# EAGLE design Arduino-Shield (EAGLE 9.6.2)
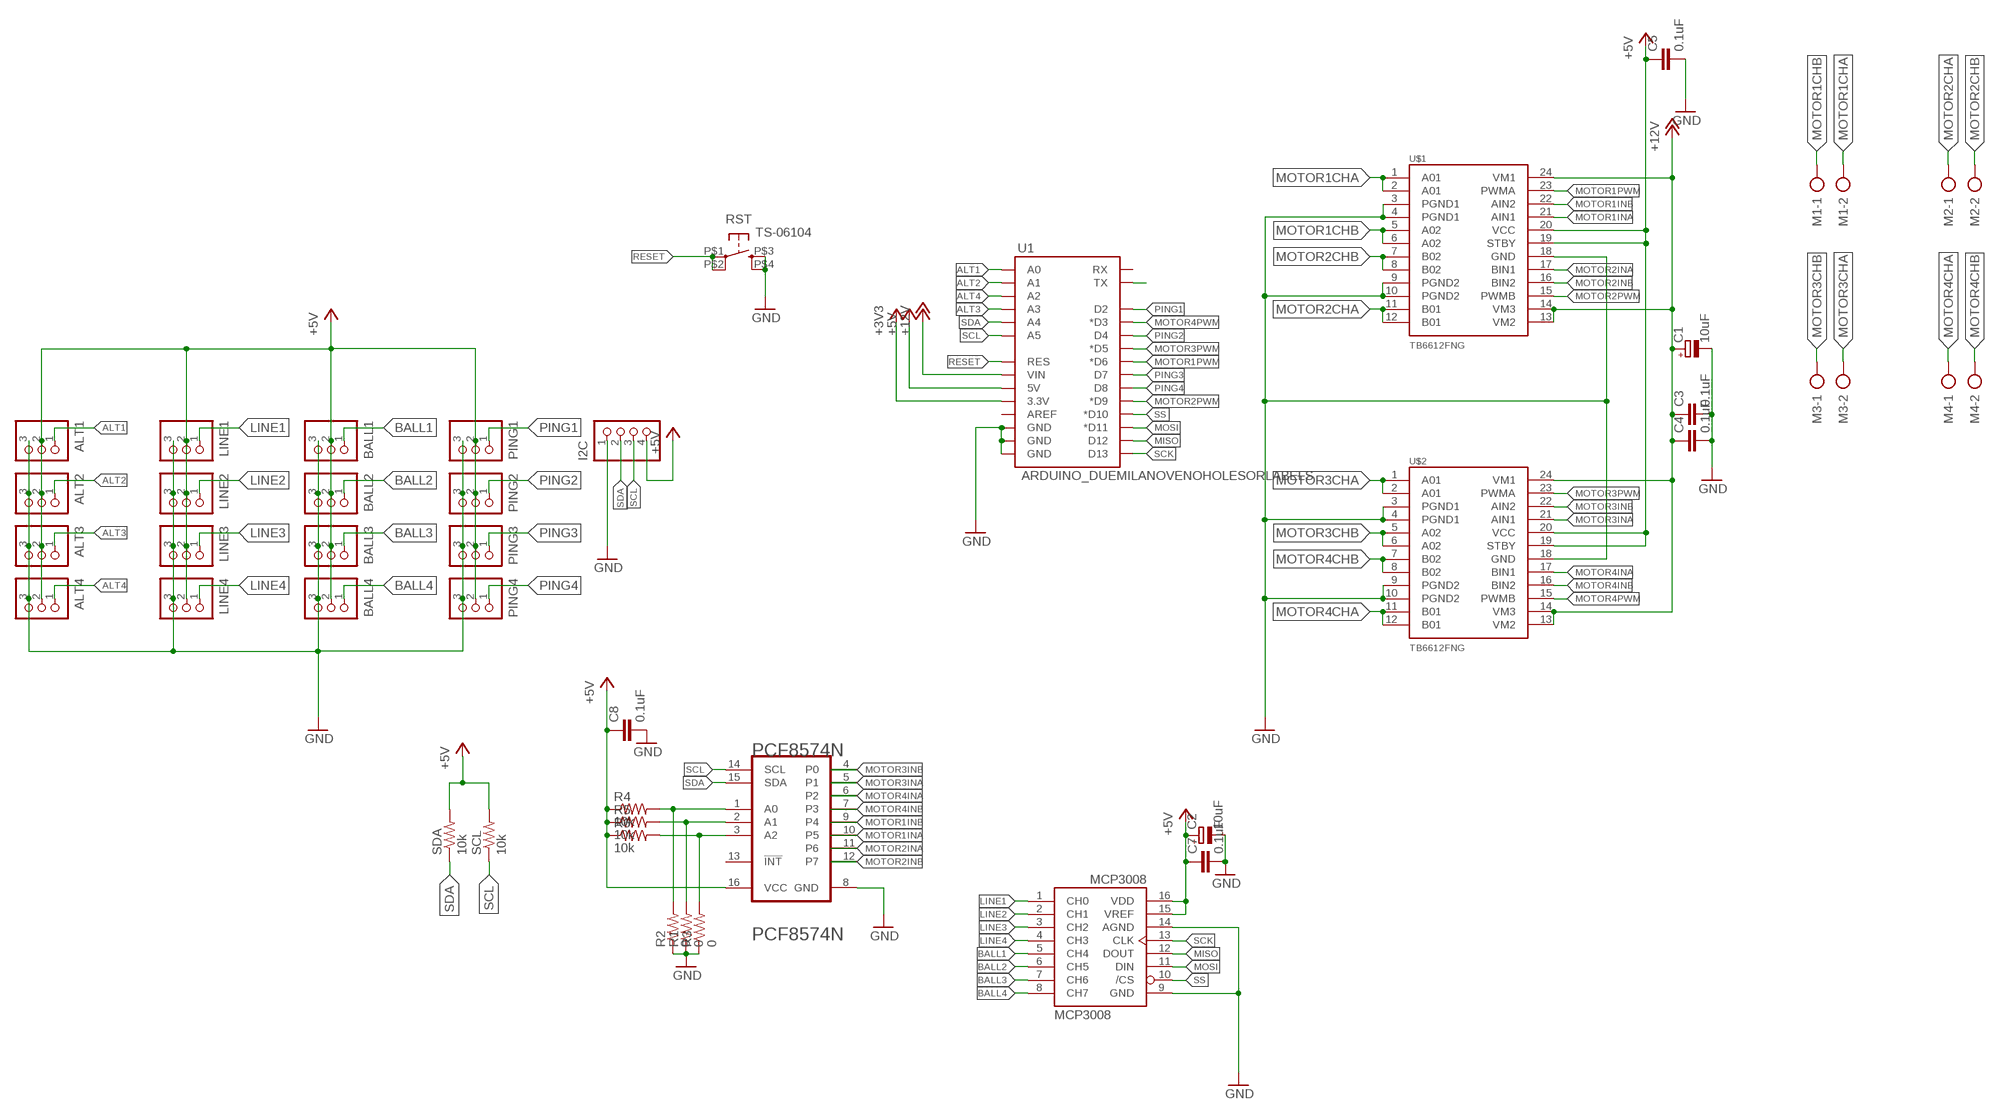
[diagram p0: schematic, sheet 1]

## Parts
ALT1  B3B-XH-A  [B3B-XH-A]
ALT2  B3B-XH-A  [B3B-XH-A]
ALT3  B3B-XH-A  [B3B-XH-A]
ALT4  B3B-XH-A  [B3B-XH-A]
BALL1  B3B-XH-A  [B3B-XH-A]
BALL2  B3B-XH-A  [B3B-XH-A]
BALL3  B3B-XH-A  [B3B-XH-A]
BALL4  B3B-XH-A  [B3B-XH-A]
C1  10uF  CPOL-EUE2-5  [E2-5]
C2  10uF  CPOL-EUE2-5  [E2-5]
C3  0.1uF  C-EUC1608  [C1608]
C4  0.1uF  C-EUC1608  [C1608]
C5  0.1uF  C-EUC1608  [C1608]
C7  0.1uF  C-EUC1608  [C1608]
C8  0.1uF  C-EUC1608  [C1608]
I2C  B4B-XH-A  [B4B-XH-A]
LINE1  B3B-XH-A  [B3B-XH-A]
LINE2  B3B-XH-A  [B3B-XH-A]
LINE3  B3B-XH-A  [B3B-XH-A]
LINE4  B3B-XH-A  [B3B-XH-A]
M1  AK500/2-H  [AK500/2-H]
M2  AK500/2-H  [AK500/2-H]
M3  AK500/2-H  [AK500/2-H]
M4  AK500/2-H  [AK500/2-H]
MCP3008  MCP3008  [DIL16]
PCF8574N  TEXAS_INSTRUMENTS_PCF8574NTEXAS_INSTRUMENTS_PCF8574N_0_0  [TEXAS_INSTRUMENTS_PCF8574N_0]
PING1  B3B-XH-A  [B3B-XH-A]
PING2  B3B-XH-A  [B3B-XH-A]
PING3  B3B-XH-A  [B3B-XH-A]
PING4  B3B-XH-A  [B3B-XH-A]
R1  0  R-US_M2012  [M2012]
R2  0  R-US_M2012  [M2012]
R3  0  R-US_M2012  [M2012]
R4  10k  R-US_R0603  [R0603]
R5  10k  R-US_R0603  [R0603]
R6  10k  R-US_R0603  [R0603]
RST  TS-06104  [TS-06104]
SCL  10k  R-US_R0603  [R0603]
SDA  10k  R-US_R0603  [R0603]
U1  ARDUINO_DUEMILANOVENOHOLESORLABELS  [DUEMILANOVE_SHIELD_NOHOLES_NOLABELS]
U$1  TB6612FNG  [SSOP24]
U$2  TB6612FNG  [SSOP24]

## Nets
+3V3: U1.3.3V
+5V: ALT1.2 ALT2.2 ALT3.2 ALT4.2 BALL1.2 BALL2.2 BALL3.2 BALL4.2 C2.+ C5.1 C7.1 C8.1 I2C.4 LINE1.2 LINE2.2 LINE3.2 LINE4.2 MCP3008.15(VREF) MCP3008.16(VDD) PCF8574N.16(VCC) PING1.2 PING2.2 PING3.2 PING4.2 R4.1 R5.1 R6.1 SCL.2 SDA.2 U1.5V U$1.19(STBY) U$1.20(VCC) U$2.19(STBY) U$2.20(VCC)
+12V: C1.+ C3.1 C4.1 U1.VIN U$1.13(VM2) U$1.14(VM3) U$1.24(VM1) U$2.13(VM2) U$2.14(VM3) U$2.24(VM1)
ALT1: ALT1.1 U1.A0
ALT2: ALT2.1 U1.A1
ALT3: ALT3.1 U1.A3
ALT4: ALT4.1 U1.A2
BALL1: BALL1.1 MCP3008.5(CH4)
BALL2: BALL2.1 MCP3008.6(CH5)
BALL3: BALL3.1 MCP3008.7(CH6)
BALL4: BALL4.1 MCP3008.8(CH7)
GND: ALT1.3 ALT2.3 ALT3.3 ALT4.3 BALL1.3 BALL2.3 BALL3.3 BALL4.3 C1.- C2.- C3.2 C4.2 C5.2 C7.2 C8.2 I2C.1 LINE1.3 LINE2.3 LINE3.3 LINE4.3 MCP3008.9(GND) MCP3008.14(AGND) PCF8574N.8(GND) PING1.3 PING2.3 PING3.3 PING4.3 R1.1 R2.1 R3.1 RST.P$3 RST.P$4 U1.GND@0(GND) U1.GND@1(GND) U1.GND@2(GND) U$1.3(PGND1) U$1.4(PGND1) U$1.9(PGND2) U$1.10(PGND2) U$1.18(GND) U$2.3(PGND1) U$2.4(PGND1) U$2.9(PGND2) U$2.10(PGND2) U$2.18(GND)
LINE1: LINE1.1 MCP3008.1(CH0)
LINE2: LINE2.1 MCP3008.2(CH1)
LINE3: LINE3.1 MCP3008.3(CH2)
LINE4: LINE4.1 MCP3008.4(CH3)
MISO: MCP3008.12(DOUT) U1.D12
MOSI: MCP3008.11(DIN) U1.D11(*D11)
MOTOR1CHA: M1.2 U$1.1(A01) U$1.2(A01)
MOTOR1CHB: M1.1 U$1.5(A02) U$1.6(A02)
MOTOR1INA: PCF8574N.10(P5) U$1.21(AIN1)
MOTOR1INB: PCF8574N.9(P4) U$1.22(AIN2)
MOTOR1PWM: U1.D6(*D6) U$1.23(PWMA)
MOTOR2CHA: M2.1 U$1.11(B01) U$1.12(B01)
MOTOR2CHB: M2.2 U$1.7(B02) U$1.8(B02)
MOTOR2INA: PCF8574N.11(P6) U$1.17(BIN1)
MOTOR2INB: PCF8574N.12(P7) U$1.16(BIN2)
MOTOR2PWM: U1.D9(*D9) U$1.15(PWMB)
MOTOR3CHA: M3.2 U$2.1(A01) U$2.2(A01)
MOTOR3CHB: M3.1 U$2.5(A02) U$2.6(A02)
MOTOR3INA: PCF8574N.5(P1) U$2.21(AIN1)
MOTOR3INB: PCF8574N.4(P0) U$2.22(AIN2)
MOTOR3PWM: U1.D5(*D5) U$2.23(PWMA)
MOTOR4CHA: M4.1 U$2.11(B01) U$2.12(B01)
MOTOR4CHB: M4.2 U$2.7(B02) U$2.8(B02)
MOTOR4INA: PCF8574N.6(P2) U$2.17(BIN1)
MOTOR4INB: PCF8574N.7(P3) U$2.16(BIN2)
MOTOR4PWM: U1.D3(*D3) U$2.15(PWMB)
N$1: PCF8574N.1(A0) R2.2 R4.2
N$2: PCF8574N.2(A1) R1.2 R5.2
N$3: PCF8574N.3(A2) R3.2 R6.2
PING1: PING1.1 U1.D2
PING2: PING2.1 U1.D4
PING3: PING3.1 U1.D7
PING4: PING4.1 U1.D8
RES2: U1.TX
RESET: RST.P$1 RST.P$2 U1.RES
SCK: MCP3008.13(CLK) U1.D13
SCL: I2C.3 PCF8574N.14(SCL) SCL.1 U1.A5
SDA: I2C.2 PCF8574N.15(SDA) SDA.1 U1.A4
SS: MCP3008.10(/CS) U1.D10(*D10)
Unconnected: PCF8574N.13(!INT!) U1.AREF U1.RX

## Library data of the parts
ALT1-ALT4 BALL1-BALL4 LINE1-LINE4 PING1-PING4 = jst-xh:B3B-XH-A: Wire-to-Board 2.5mm pitch top mount connector Source: http://www.jst-mfg.com/product/pdf/jpn/XH.pdf http://www.jst-mfg.com/product/detail.php?series=277
C1 C2 = rcl:CPOL-EU: POLARIZED CAPACITOR, European symbol; SPICEPREFIX: C
C3-C5 C7 C8 = rcl:C-EU: CAPACITOR, European symbol; SPICEPREFIX: C
I2C = jst-xh:B4B-XH-A: Wire-to-Board 2.5mm pitch top mount connector Source: http://www.jst-mfg.com/product/pdf/jpn/XH.pdf http://www.jst-mfg.com/product/detail.php?series=277
M1-M4 = con-ptr500:AK500/2-H: CONNECTOR Aug. 2004 / PTR Meßtechnik: Die Bezeichnung der Serie AK505 wurde geändert. Es handelt sich hierbei um AK500 in horizontaler Ausführung.; OC_FARNELL: unknown; OC_NEWARK: unknown
MCP3008 = adafruit:MCP3008
PCF8574N = Texas Instruments - PCF8574N:TEXAS_INSTRUMENTS_PCF8574N: TI-PCF8574-PDIP_N-16; CIIVA_IDS: 13592404; CODE__JEDEC: MS-001*; COMPONENT_LINK_2_DESCRIPTION: Package Specification; COMPONENT_LINK_2_URL: http://www.ti.com/litv/pdf/mpdi002c; DATASHEET: http://www.ti.com/general/docs/lit/getliterature.tsp?genericPartNumber=PCF8574&fileType=pdf; DATASHEET_VERSION: SCPS068G; FOOTPRINT_VARIANT_NAME_0: Manufacturer Recommended; F_SCLK_MAX_MHZ: 0.1; I2C_ADDRESS: 0100 xxx; IMPORTED: yes; IMPORTED_FROM: vault; IMPORT_TS: 1521849915; INTERRUPT_OUTPUT: Yes; MAX_FREQUENCYKHZ: 100; MF: Texas Instruments; MOUNTING_TECHNOLOGY: Through-hole; MPN: PCF8574N; OF_IOS: 8; PACKAGE: N0016A; PACKAGE_DESCRIPTION: 16-Pin Plastic Dual-In-Line Package, Row Spacing 7.62 mm, Pitch 2.54 mm; PACKAGE_VERSION: revE, Dec-2002; PIN_0_0_13_INSIDE_EDGE: clock; PREFIX: U; PUSH_PULL_IO_TYPE: Yes; RELEASE_DATE: 1464327319; RESET_INPUT: No; ROHS: Yes; SUB_FAMILY: I2C IO Expander; VAULT_GUID: 6B0A092C-00FE-4CEB-88E1-FCBDED8643F9; VAULT_REVISION: 6B172042-FB17-4171-84B5-EE9A058F64BE; VCC_MAX_V: 6; VCC_MIN_V: 2.5; VCC_RANGEV: 2.5 to 6.0; VOLTAGE_NODESV: 5, 3.3
R1-R6 SCL SDA = rcl:R-US_: RESISTOR, American symbol; SPICEPREFIX: R
RST = 0@Mylibrary-main1:TS-06104
U1 = SparkFun-Retired:ARDUINO_DUEMILANOVE: Arduino Duemilanove Shield Footprint Shield form compatible with the Arduino Duemilanove.
U$1 U$2 = SparkFun-IC-Special-Function:TB6612FNG: Toshiba 1A dual motor driver IC-09363; PROD_ID: IC-09363

## Board
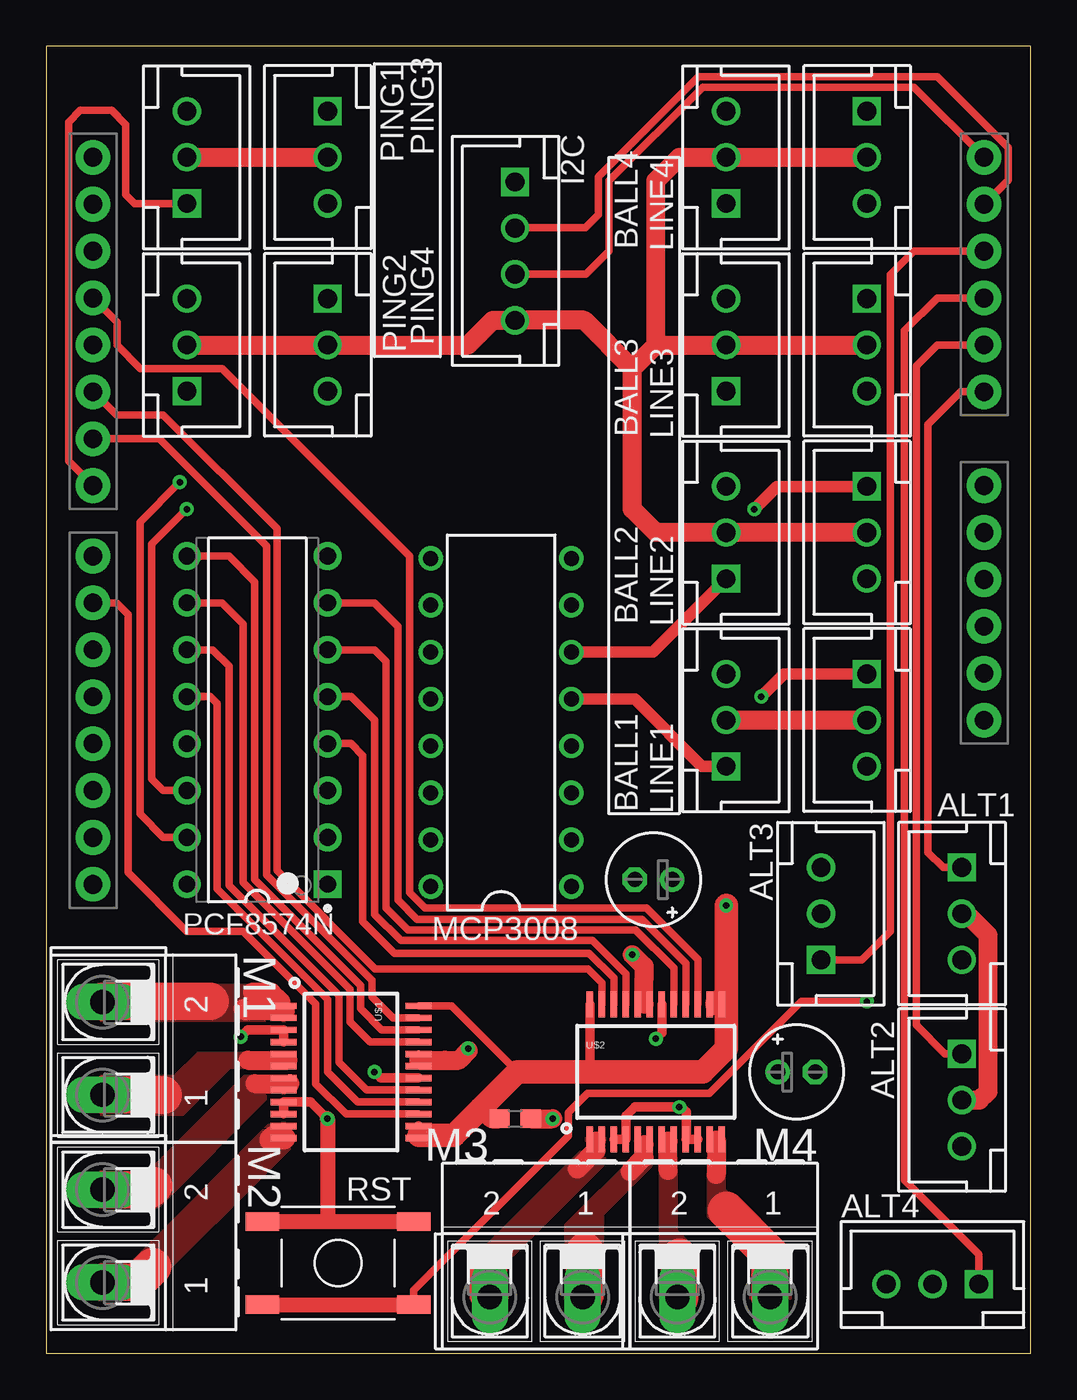
[diagram p1: board, top side]
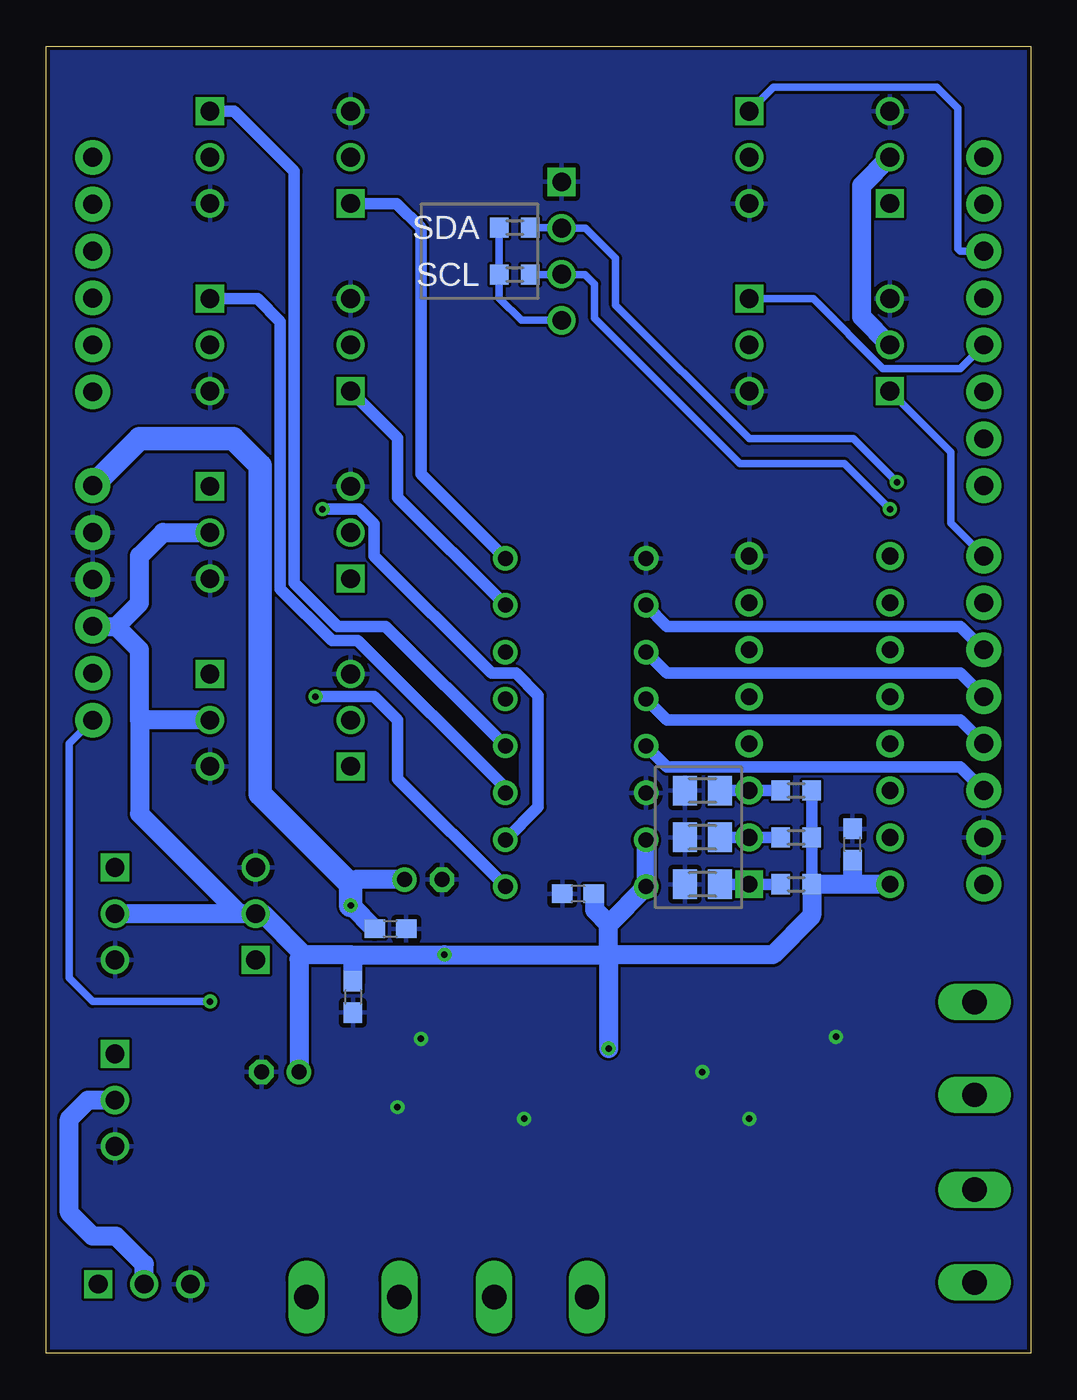
[diagram p2: board, bottom side, seen from below]

Size 53.32 x 70.79 mm. Coordinates in mm from the lower left corner, seen from the top.
Outline: 0,0 53.32,0 53.32,70.79 0,70.79 0,0
Copper layers (1*16): Top 0.035mm / dielectric 1.5mm / Bottom 0.035mm
Design rules "PCBGoGo": minimum track width 6mil, minimum drill 0.2mm, track to track 6mil, track to pad 6mil, pad to pad 6mil, via to via 6mil, smd to smd 6mil, copper to edge 0.2mm, drill to drill 6mil, minimum pad ring 10mil, minimum via ring 8mil, stop-mask expansion 4mil, vias tented up to drill 0mil, thermal gap 10mil
bRestrict: 7 lines

### Footprints (pad centres in the part's own frame; a part is rotated, then mirrored left to right if it is on the bottom)
B3B-XH-A = drill 1.016 square: 1 -2.5,0 | drill 1.016: 2 0,0; 3 2.5,0
E2-5 = drill 0.813 pad 1.27: + -1.016,0 | drill 0.813 pad 1.27 octagon: - 1.016,0
C1608 = smd 1.1 x 1: 1 -0.85,0; 2 0.85,0
B4B-XH-A = drill 1.016 square: 1 -3.75,0 | drill 1.016: 2 -1.25,0; 3 1.25,0; 4 3.75,0
AK500/2-H = drill 1.321 long: 1 -2.515,0; 2 2.515,0
DIL16 = drill 0.813: 1 -8.89,-3.81; 2 -6.35,-3.81; 3 -3.81,-3.81; 4 -1.27,-3.81; 5 1.27,-3.81; 6 3.81,-3.81; 7 6.35,-3.81; 8 8.89,-3.81; 9 8.89,3.81; 10 6.35,3.81; 11 3.81,3.81; 12 1.27,3.81; 13 -1.27,3.81; 14 -3.81,3.81; 15 -6.35,3.81; 16 -8.89,3.81
TEXAS_INSTRUMENTS_PCF8574N_0 = drill 0.9 pad 1.5 square: 1 -3.81,8.89 | drill 0.9 pad 1.5: 2 -3.81,6.35; 3 -3.81,3.81; 4 -3.81,1.27; 5 -3.81,-1.27; 6 -3.81,-3.81; 7 -3.81,-6.35; 8 -3.81,-8.89; 9 3.81,-8.89; 10 3.81,-6.35; 11 3.81,-3.81; 12 3.81,-1.27; 13 3.81,1.27; 14 3.81,3.81; 15 3.81,6.35; 16 3.81,8.89
M2012 = smd 1.3 x 1.6: 1 -0.95,0; 2 0.95,0
R0603 = smd 1 x 1.1: 1 -0.85,0; 2 0.85,0
TS-06104 = smd 1.8 x 1: P$1 4.1,2.25; P$2 -4.1,2.25; P$3 -4.1,-2.25; P$4 4.1,-2.25
DUEMILANOVE_SHIELD_NOHOLES_NOLABELS = drill 1.016 pad 1.88: 3.3V 50.8,26.67; 5V 50.8,29.21; A0 50.8,41.91; A1 50.8,44.45; A2 50.8,46.99; A3 50.8,49.53; A4 50.8,52.07; A5 50.8,54.61; AREF 2.54,15.24; D2 2.54,49.53; D3 2.54,46.99; D4 2.54,44.45; D5 2.54,41.91; D6 2.54,39.37; D7 2.54,36.83; D8 2.54,33.02; D9 2.54,30.48; D10 2.54,27.94; D11 2.54,25.4; D12 2.54,22.86; D13 2.54,20.32; GND@0 50.8,31.75; GND@1 50.8,34.29; GND@2 2.54,17.78; RES 50.8,24.13; RX 2.54,54.61; TX 2.54,52.07; VIN 50.8,36.83
SSOP24 = smd 0.348 x 1.397: 1 -3.575,-3.656; 2 -2.925,-3.656; 3 -2.275,-3.656; 4 -1.625,-3.656; 5 -0.975,-3.656; 6 -0.325,-3.656; 7 0.325,-3.656; 8 0.975,-3.656; 9 1.625,-3.656; 10 2.275,-3.656; 11 2.925,-3.656; 12 3.575,-3.656; 13 3.575,3.656; 14 2.925,3.656; 15 2.275,3.656; 16 1.625,3.656; 17 0.975,3.656; 18 0.325,3.656; 19 -0.325,3.656; 20 -0.975,3.656; 21 -1.625,3.656; 22 -2.275,3.656; 23 -2.925,3.656; 24 -3.575,3.656

### Placement (x,y rotation side)
ALT1  49.59,23.81 270 top
ALT2  49.59,13.72 270 top
ALT3  41.97,23.81 90 top
ALT4  48.01,3.75 180 top
BALL1  36.83,34.29 90 top
BALL2  36.83,44.45 90 top
BALL3  36.83,54.61 90 top
BALL4  36.83,64.77 90 top
C1  32.89,25.65 180 top
C2  40.64,15.24 0 top
C3  25.4,12.7 0 top
C4  34.67,22.99 0 bottom
C5  9.65,27.56 90 bottom
C7  24.51,24.89 180 bottom
C8  36.7,19.3 270 bottom
I2C  25.4,59.69 270 top
LINE1  44.45,34.29 270 top
LINE2  44.45,44.45 270 top
LINE3  44.45,54.61 270 top
LINE4  44.45,64.77 270 top
M1  3.05,16.51 90 top
M2  3.05,6.35 90 top
M3  26.54,3.05 180 top
M4  36.7,3.05 180 top
MCP3008  24.64,34.16 90 top
PCF8574N  11.43,34.29 180 top
PING1  15.24,64.77 270 top
PING2  15.24,54.61 270 top
PING3  7.62,64.77 90 top
PING4  7.62,54.61 90 top
R1  17.78,27.94 0 bottom
R2  17.78,25.4 0 bottom
R3  17.78,30.48 0 bottom
R4  12.7,25.4 180 bottom
R5  12.7,27.94 180 bottom
R6  12.7,30.48 180 bottom
RST  15.81,4.89 180 top
SCL  27.94,58.42 180 bottom
SDA  27.94,60.96 180 bottom
U1  0,10.16 0 top
U$1  16.51,15.24 270 top
U$2  33.02,15.24 0 top
U$3  [RODEP2]  30.48,10.16 0 bottom

### Tracks (layer width: path | path; a pad name or v marks a point on that pad's centre or on a via)
+5V  (via drill 0.35)
  Top 0.406: U$2.20 U$2.19 32.38,19.21 32.38,20.32 | U$1.20 U$1.19 20.48,15.87 21.59,15.87
  Top 0.508: v22.86,16.51 22.86,16.38
  Top 1.016: LINE4.2 BALL4.2 34.29,64.77 33.02,63.5 33.02,54.61 | BALL1.2 LINE1.2 | LINE2.2 BALL2.2 33.02,44.45 31.75,45.72 31.75,53.34 | 33.02,54.61 31.75,53.34 | 33.02,54.61 BALL3.2 LINE3.2 | 31.75,53.34 29.15,55.94 I2C.4 24.19,55.94 22.86,54.61 PING2.2 PING4.2 | PING3.2 PING1.2 | 20.19,15.87 21.59,15.87 22.35,15.87 22.86,16.38 | 32.38,18.92 32.38,20.32 32.38,20.95 v31.75,21.59 | ALT1.2 49.85,23.81 51.02,22.64 51.02,14.19 50.55,13.72 ALT2.2
  Bottom 0.406: SDA.2 SCL.2 28.79,57.15 27.58,55.94 I2C.4
  Bottom 0.61: R6.1 R5.1 R4.1
  Bottom 1.016: PCF8574N.16 9.65,25.4 | 9.65,25.4 R4.1 11.85,23.71 13.97,21.59 22.86,21.59 | 36.83,21.59 39.37,21.59 | 36.83,21.59 v31.75,21.59 22.86,21.59 | 22.86,21.59 v22.86,16.51 | 49.53,39.37 48.26,38.1 48.26,34.29 | U1.5V 49.53,39.37 | 48.26,34.29 48.26,29.21 42.86,23.81 ALT3.2 | 49.53,39.37 48.26,40.64 48.26,43.18 46.99,44.45 LINE2.2 | LINE1.2 48.26,34.29 | MCP3008.15 MCP3008.16 22.86,23.24 | 22.86,21.59 22.86,23.24 | PING4.2 9.14,56.13 9.14,63.25 PING3.2 | C8.1 36.7,21.46 36.83,21.59 | C7.1 23.62,24.85 23.62,24 22.86,23.24 | C5.1 9.65,25.4 | ALT3.2 41.59,23.81 39.37,21.59 | 39.37,21.59 39.62,21.34 C2.+ | ALT4.2 48.01,4.83 49.53,6.35 50.8,6.35 52.07,7.62 52.07,12.7 51.05,13.72 ALT2.2 | ALT1.2 ALT3.2
+12V  (via drill 0.35)
  Top 0.406: 25.53,15.24 21.95,18.81 U$1.24
  Top 0.508: U$2.24 29.45,15.47 29.21,15.24 | U$2.14 36.1,19.05 36.83,19.05 36.68,18.9 U$2.13 | U$1.14 U$1.13 20.17,11.78 20.19,11.81
  Top 1.016: 23.56,13.27 24.13,12.7 C3.1
  Top 1.27: 36.32,18.92 36.83,19.43 v36.83,24.26 36.83,19.05 36.83,16.51 35.56,15.24 29.21,15.24 25.53,15.24 23.56,13.27 22.1,11.81 20.19,11.81
  Bottom 1.016: C1.+ 36.58,25.65 36.83,25.4 | C4.1 36.79,24.26 v36.83,24.26
  Bottom 1.27: U1.VIN 48.26,49.53 43.18,49.53 41.73,48.08 41.73,30.3 36.83,25.4 v36.83,24.26
ALT1
  Top 0.406: U1.A0 49.53,52.07 47.75,50.29 47.75,27.14 48.58,26.31 ALT1.1
ALT2
  Top 0.406: U1.A1 48.26,54.61 47.12,53.47 47.12,17.78 48.68,16.22 ALT2.1
ALT3
  Top 0.406: U1.A3 46.99,59.69 45.72,58.42 45.72,22.86 44.17,21.31 ALT3.1
ALT4
  Top 0.406: U1.A2 48.26,57.15 46.48,55.37 46.48,12.7 46.48,12.19 46.48,9.4 50.51,5.37 ALT4.1
BALL1
  Top 0.61: BALL1.1 35.52,31.79 31.88,35.43 MCP3008.5
BALL2
  Top 0.61: MCP3008.6 32.85,37.97 BALL2.1
BALL3
  Bottom 0.61: MCP3008.7 34.29,46.36 34.29,49.57 BALL3.1
BALL4
  Bottom 0.61: MCP3008.8 33.02,47.62 33.02,60.96 34.33,62.27 BALL4.1
GND  (via drill 0.35)
  Top 0.508: U$1.10 U$1.9 14.32,13.62 v15.24,12.7 | U$1.4 U$1.3 10.91,17.52 v10.54,17.15 | U$1.18 18.11,14.92 v17.78,15.24 | U$2.3 U$2.4 31.39,12.85 31.88,13.33 v34.29,13.33 34.42,13.33 34.67,13.08 34.67,11.61 U$2.9 U$2.10 | U$2.18 33.34,17.36 v33.02,17.03
  Top 0.813: RST.P$4 15.24,7.14 | 15.24,7.14 RST.P$3 | v15.24,12.7 15.24,7.14
  Top 1.016: C3.2 v27.43,12.7
  pour Bottom: -2.54,73.66 57.15,73.66 57.15,-1.27 -2.54,-1.27
LINE1  (via drill 0.35)
  Top 0.61: v38.73,35.56 39.97,36.79 LINE1.1
  Bottom 0.61: MCP3008.1 34.29,31.12 34.29,34.29 35.56,35.56 v38.73,35.56
LINE2  (via drill 0.35)
  Top 0.61: v38.35,45.72 39.58,46.95 LINE2.1
  Bottom 0.61: MCP3008.2 26.67,29.59 26.67,35.62 27.88,36.83 29.21,36.83 35.56,43.18 35.56,44.9 36.38,45.72 v38.35,45.72
LINE3
  Bottom 0.61: MCP3008.3 28.45,30.61 36.45,38.61 37.85,38.61 40.64,41.4 40.64,55.88 41.87,57.11 LINE3.1
LINE4
  Bottom 0.61: MCP3008.4 34.92,39.37 37.53,39.37 39.88,41.72 39.88,64.01 43.14,67.27 LINE4.1
MISO
  Bottom 0.61: U1.D12 3.81,34.29 19.68,34.29 MCP3008.12
MOSI
  Bottom 0.61: U1.D11 3.81,36.83 19.68,36.83 MCP3008.11
MOTOR1CHA
  Top 1.016: 12.95,18.54 10.79,18.54 10.67,18.67 | 12.7,19.05 12.19,19.56 11.18,19.56
  Top 2.032: M1.2 3.07,19.05 8.89,19.05
  pour Top: 12.95,18.03 2.29,18.03 2.16,18.16 1.65,18.67 1.65,19.43 2.16,19.94 3.81,19.94 12.19,19.94 13.21,18.92 13.21,18.29
MOTOR1CHB
  Top 1.016: 10.92,15.87 13.08,15.87
  Top 2.032: M1.1 6.33,13.99 6.35,13.97
  pour Top: 12.95,15.49 9.91,15.49 7.37,12.95 2.16,12.95 1.27,13.84 1.27,14.22 2.03,14.99 6.99,14.99 8.26,16.26 12.83,16.26 13.08,16 13.08,15.62
MOTOR1INA
  Top 0.406: U$1.21 17.55,16.87 16.46,17.96 16.46,19.71 10.67,25.5 10.67,39.5 9.53,40.64 PCF8574N.10
MOTOR1INB
  Top 0.406: PCF8574N.9 9.91,43.18 11.3,41.78 11.3,25.65 17.02,19.94 17.02,18.67 18.17,17.52 U$1.22
MOTOR1PWM
  Top 0.406: U$1.23 19.05,18.16 18.92,18.16 18.8,18.16 17.65,19.31 17.65,20.19 11.94,25.91 11.94,43.71 6.12,49.53 U1.D6
MOTOR2CHA
  Top 1.27: U$1.12 12.3,11.67 12.19,11.56
  Top 2.032: 3.02,3.84 4.92,3.84 5.78,4.7
  pour Top: 13.21,12.45 12.19,12.45 4.54,4.79 2.64,4.79 1.4,3.56 3.17,2.92 3.27,2.83 4.86,2.83 13.34,11.3 13.34,12.32
MOTOR2CHB
  Top 1.016: 11.3,14.6 13.21,14.6
  Top 2.032: M2.2 5.59,8.86 5.81,9.08
  pour Top: 1.46,7.94 1.4,8 1.4,8.89 2.35,9.84 5.62,9.84 10.76,14.99 12.95,14.99 13.21,14.73 13.21,14.22 13.08,14.1 12.19,14.1 6.03,7.94
MOTOR2INA
  Top 0.406: U$1.17 17.36,14.26 15.88,15.75 15.88,19.37 9.91,25.34 9.91,37.21 9.02,38.1 PCF8574N.11
MOTOR2INB
  Top 0.406: U$1.16 16.86,13.62 15.24,15.24 15.24,19.18 9.27,25.15 9.27,35.18 8.89,35.56 PCF8574N.12
MOTOR2PWM
  Top 0.406: U$1.15 16.25,12.97 14.61,14.6 14.61,18.92 10.67,22.86 7.62,22.86 4.45,26.03 4.45,40.01 3.81,40.64 U1.D9
MOTOR3CHA
  Top 1.016: 28.77,9.97 29.78,10.99 29.78,11.49
  Top 2.032: 23.97,3.18 23.97,4.86
  pour Top: 24.96,1.71 24.96,5.02 30.23,10.29 30.23,12 30.16,12.06 29.4,12.06 29.27,11.94 29.27,11.24 23.02,4.98 23.02,1.28 24.98,1.32
MOTOR3CHB
  Top 1.016: 31.62,9.84 32.38,10.6 32.38,11.3
  Top 2.032: 29.15,3.08 29.15,5.49 29.18,5.52
  pour Top: 31.88,11.49 31.88,10.67 28.17,6.96 28.14,1.15 30.11,1.17 30.13,1.56 30.13,7.52 32.77,10.16 32.77,11.56 32.64,11.68 32.07,11.68
MOTOR3INA
  Top 0.406: U$2.21 31.39,20.55 29.59,22.35 19.21,22.35 17.78,23.78 17.78,34.29 16.51,35.56 PCF8574N.5
MOTOR3INB
  Top 0.406: PCF8574N.4 16.51,33.02 17.14,32.39 17.14,23.4 18.88,21.67 29.4,21.67 30.75,20.32 U$2.22
MOTOR3PWM
  Top 0.406: U$2.23 30.09,20.07 29.34,20.83 17.81,20.83 12.5,26.14 12.5,44.65 6.35,50.8 3.81,50.8 U1.D5
MOTOR4CHA
  Top 1.016: 36.29,11.56 36.29,9.68
  Top 2.032: M4.1 39.21,5.37 36.83,7.75
  pour Top: 38.16,0.86 40.29,0.86 40.29,5.3 36.7,8.89 36.7,11.68 36.58,11.81 36,11.81 35.88,11.68 35.88,7.43 38.16,5.14
MOTOR4CHB
  Top 1.016: 33.69,9.91 33.69,11.49
  Top 2.032: 34.29,2.97 34.29,5.21
  pour Top: 33.27,1.08 35.23,1.08 35.23,5.53 34.1,6.67 34.1,11.56 33.85,11.81 33.4,11.81 33.27,11.68
MOTOR4INA
  Top 0.406: U$2.17 33.99,20.87 31.93,22.94 19.61,22.94 18.41,24.13 18.41,37.47 17.78,38.1 PCF8574N.6
MOTOR4INB
  Top 0.406: U$2.16 34.65,21.11 32.26,23.49 20.1,23.49 19.05,24.54 19.05,39.37 17.78,40.64 PCF8574N.7
MOTOR4PWM
  Top 0.406: U$2.15 35.3,21.34 32.5,24.13 20.51,24.13 19.68,24.95 19.68,43.18 9.53,53.34 5.11,53.34 3.83,54.61 3.83,55.86 U1.D3
N$1
  Bottom 0.61: R4.2 PCF8574N.1 R2.2
N$2
  Bottom 0.61: R5.2 PCF8574N.2 R1.2
N$3
  Bottom 0.61: R3.2 PCF8574N.3 R6.2
PING1
  Bottom 0.406: PING1.1 13.93,68.58 5.08,68.58 3.94,67.44 3.94,59.82 3.81,59.69 U1.D2
PING2
  Bottom 0.406: PING2.1 11.77,57.11 8,53.34 3.81,53.34 U1.D4
PING3
  Top 0.406: PING3.1 4.79,62.27 4.32,62.74 4.32,66.55 3.56,67.31 1.85,67.31 1.22,66.67 1.22,48.31 U1.D7
PING4
  Bottom 0.406: PING4.1 4.32,48.81 4.32,44.96 U1.D8
RESET  (via drill 0.35)
  Top 0.406: RST.P$2 19.91,3.4 28.3,11.79 28.3,13.06 29.31,14.07 35.91,14.07 40.89,19.05 v44.45,19.05
  Top 0.813: RST.P$1 RST.P$2
  Bottom 0.406: U1.RES 52.07,33.02 52.07,20.32 50.8,19.05 v44.45,19.05
SCK
  Bottom 0.61: U1.D13 3.81,31.75 19.68,31.75 MCP3008.13
SCL  (via drill 0.35)
  Top 0.406: U1.A5 46.99,68.58 35.56,68.58 30.48,63.5 30.48,59.69 29.23,58.44 I2C.3 | PCF8574N.14 6.35,30.48 5.71,31.12 5.71,43.82 v7.62,45.72
  Bottom 0.406: I2C.3 25.38,58.42 | 25.38,58.42 24.13,58.42 23.62,57.91 23.62,56.07 15.75,48.2 10.1,48.2 v7.62,45.72 | SCL.1 25.38,58.42
SDA  (via drill 0.35)
  Top 0.406: I2C.2 25.42,60.96 29.21,60.96 29.92,61.67 29.92,63.73 35.33,69.14 48.26,69.14 52.1,65.3 52.1,63.53 U1.A4 | PCF8574N.15 6.35,27.94 5.08,29.21 5.08,45.02 v7.24,47.18
  Bottom 0.406: v7.24,47.18 9.59,49.53 15.24,49.53 22.48,56.77 22.48,59.31 24.11,60.94 I2C.2 25.42,60.96 SDA.1
SS
  Bottom 0.61: U1.D10 3.81,39.37 19.68,39.37 MCP3008.10

### Text on the board
bDocu: optional | I2C Addres : 0b0100xxx[R/W] | Address Pad | Designed by Kayaki | v1 | Soccer Robot Shield for Arduino UNO | 2022/05/27